# EAGLE design RS485 to Neopixel (EAGLE 9.4.2)
RS485 to NeoPixel
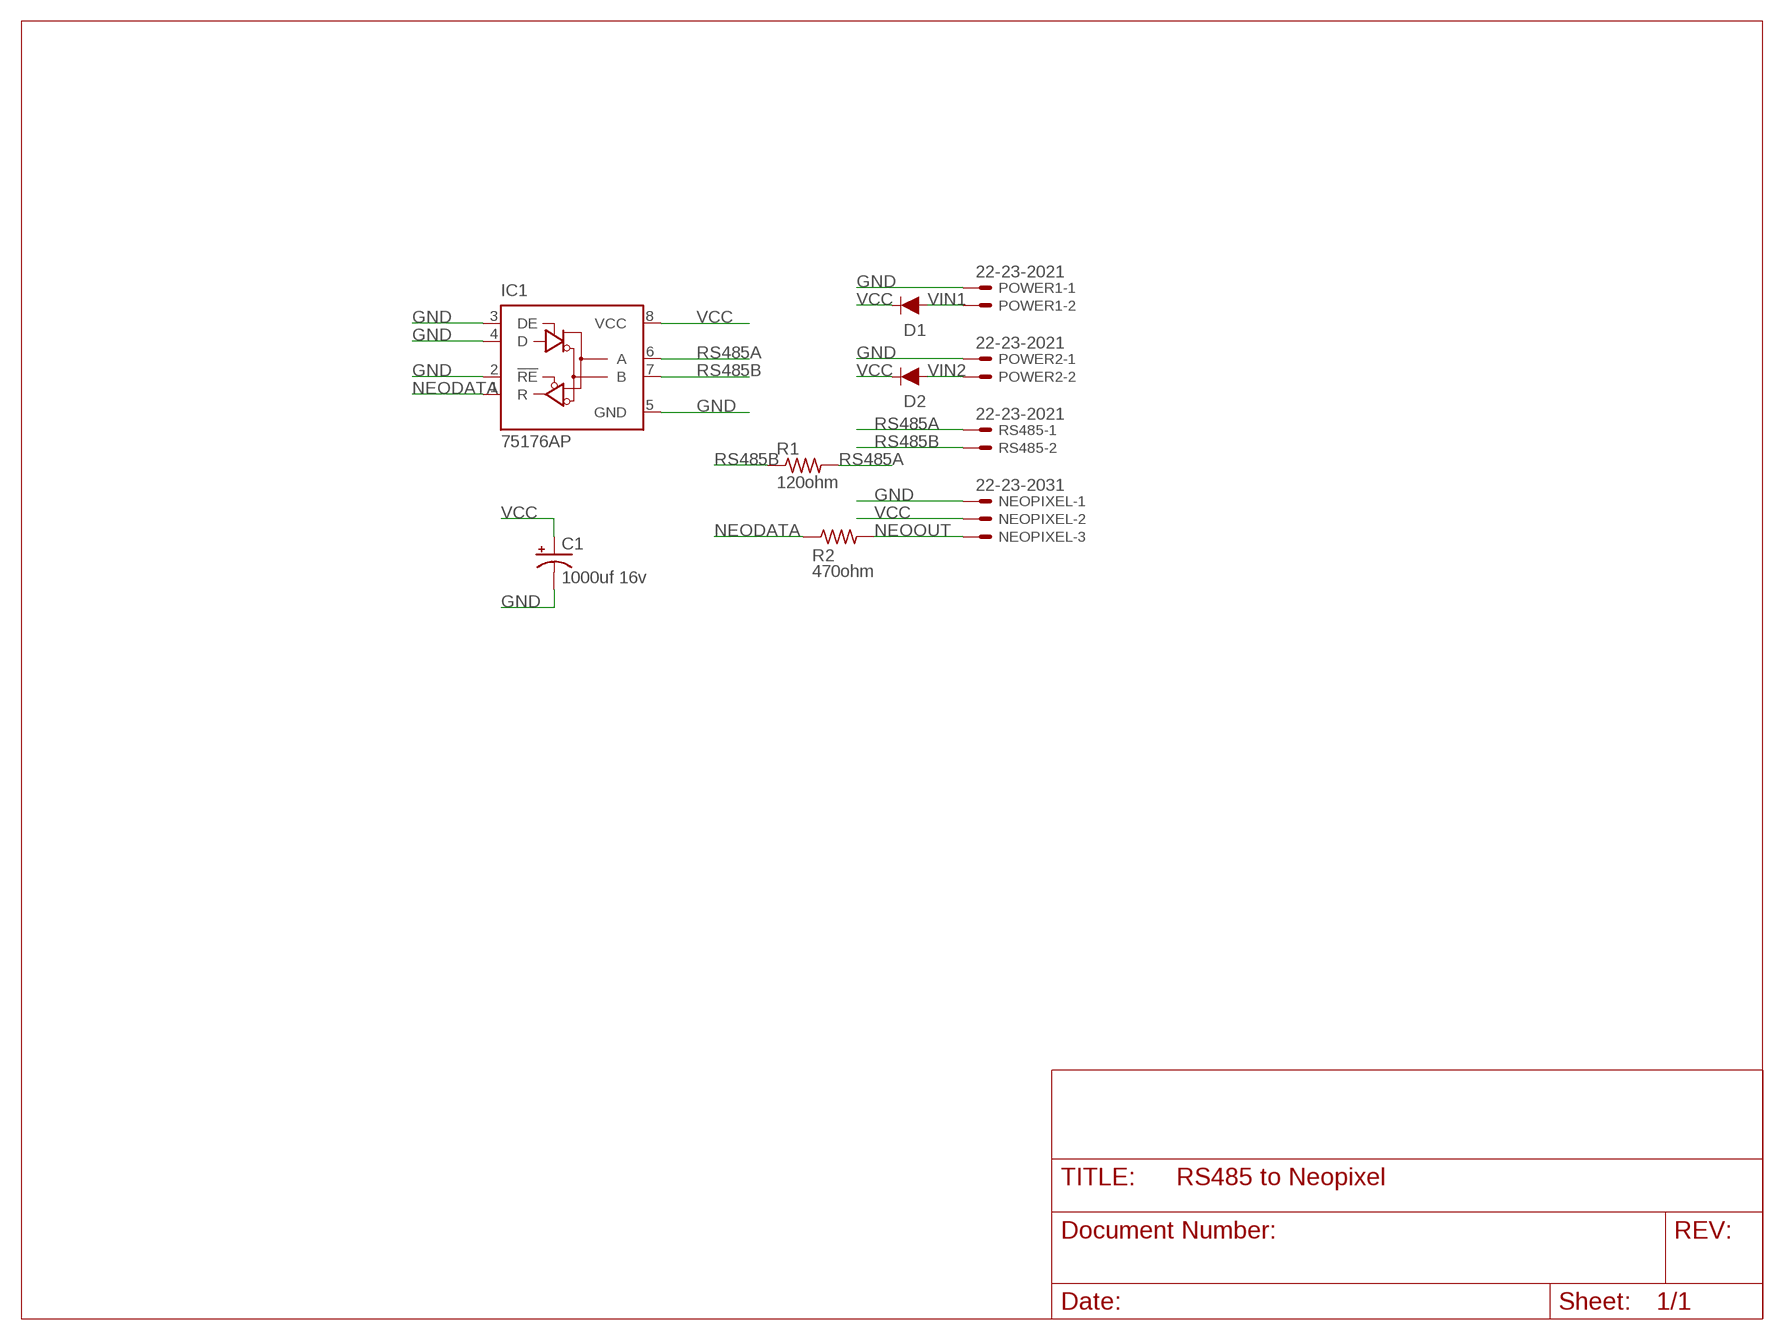
[diagram p0: schematic, sheet 1]

## Parts
C1  1000uf 16v  1000UF-RADIAL-5MM-25V-20%  [CPOL-RADIAL-5MM-10MM]
D1  1A/50V/1.1V  DIODE-PTH  [DIODE-1N4001]
D2  1A/50V/1.1V  DIODE-PTH  [DIODE-1N4001]
IC1  75176AP  [DIL08]
NEOPIXEL  22-23-2031  [22-23-2031]
POWER1  22-23-2021  [22-23-2021]
POWER2  22-23-2021  [22-23-2021]
R1  120ohm  R-US_0207/10  [0207/10]
R2  470ohm  R-US_0207/10  [0207/10]
RS485  22-23-2021  [22-23-2021]

## Nets
GND: C1.- IC1.2(!RE) IC1.3(DE) IC1.4(D) IC1.5(GND) NEOPIXEL.1 POWER1.1 POWER2.1
NEODATA: IC1.1(R) R2.1
NEOOUT: NEOPIXEL.3 R2.2
RS485A: IC1.6(A) R1.2 RS485.1
RS485B: IC1.7(B) R1.1 RS485.2
VCC: C1.+ D1.C D2.C IC1.8(VCC) NEOPIXEL.2
VIN1: D1.A POWER1.2
VIN2: D2.A POWER2.2

## Library data of the parts
C1 = SparkFun-Capacitors:1000UF: 1,000µF/1mF ceramic capacitors A capacitor is a passive two-terminal electrical component used to store electrical energy temporarily in an electric field. CAP-08070; PROD_ID: CAP-09538; VALUE: 1mF
D1 D2 = SparkFun-DiscreteSemi:DIODE: Diode These are standard reverse protection diodes and small signal diodes. SparkFun Products: SparkFun SparkPunk Sound Kit <https://www.sparkfun.com/products/11177> SparkFun ESP8266 Thing <https://www.sparkfun.com/products/13231>; PROD_ID: DIO-09176
IC1 = 751xx:75176A: DIFFERENTIAL BUS TRANSCEIVER Source: http://focus.ti.com/lit/ds/symlink/sn75176a.pdf
NEOPIXEL = con-molex:22-23-2031: .100" (2.54mm) Center Header - 3 Pin; MF: MOLEX; MPN: 22-23-2031; OC_FARNELL: 1462950; OC_NEWARK: 30C0862
POWER1 POWER2 RS485 = con-molex:22-23-2021: .100" (2.54mm) Center Header - 2 Pin; MF: MOLEX; MPN: 22-23-2021; OC_FARNELL: 1462926; OC_NEWARK: 25C3832
R1 R2 = rcl:R-US_: RESISTOR, American symbol; SPICEPREFIX: R

## Board
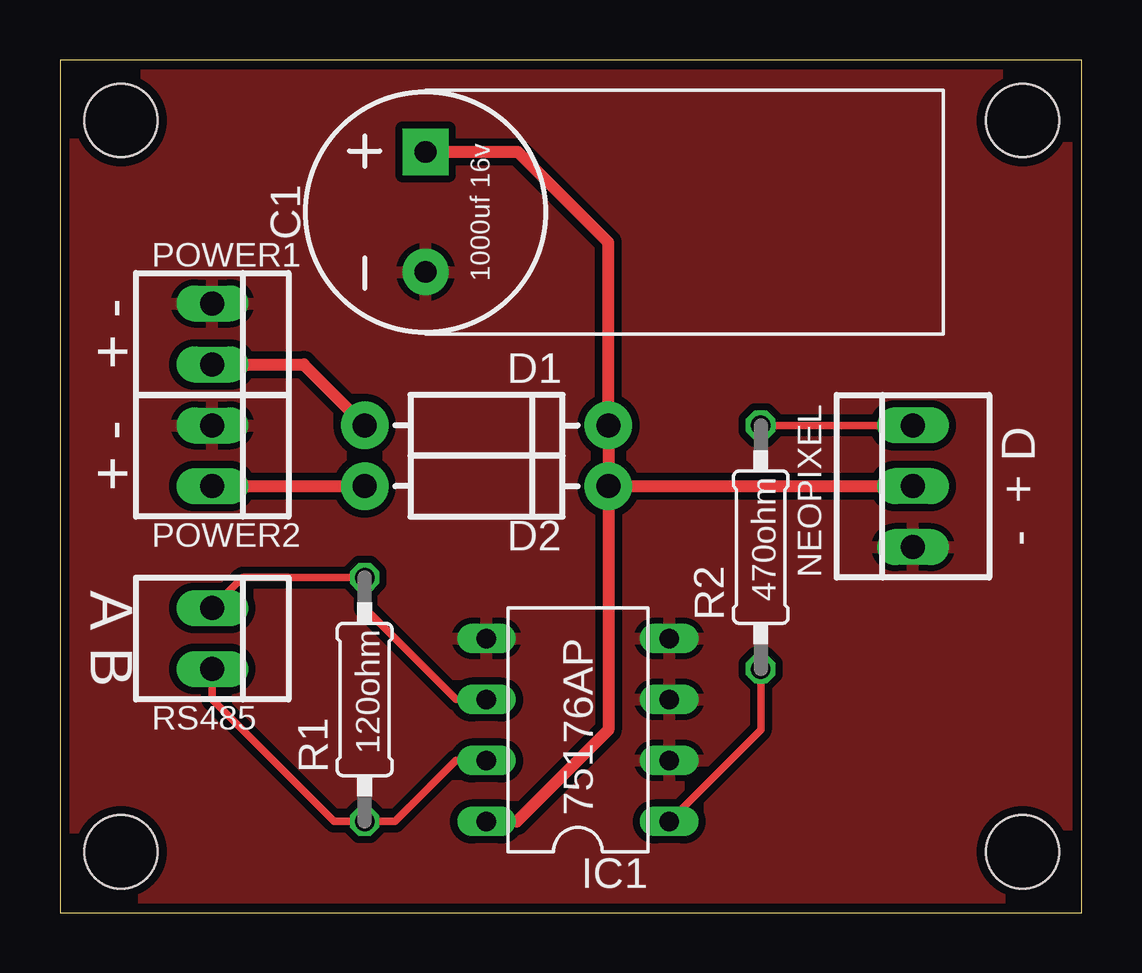
[diagram p1: board, top side]
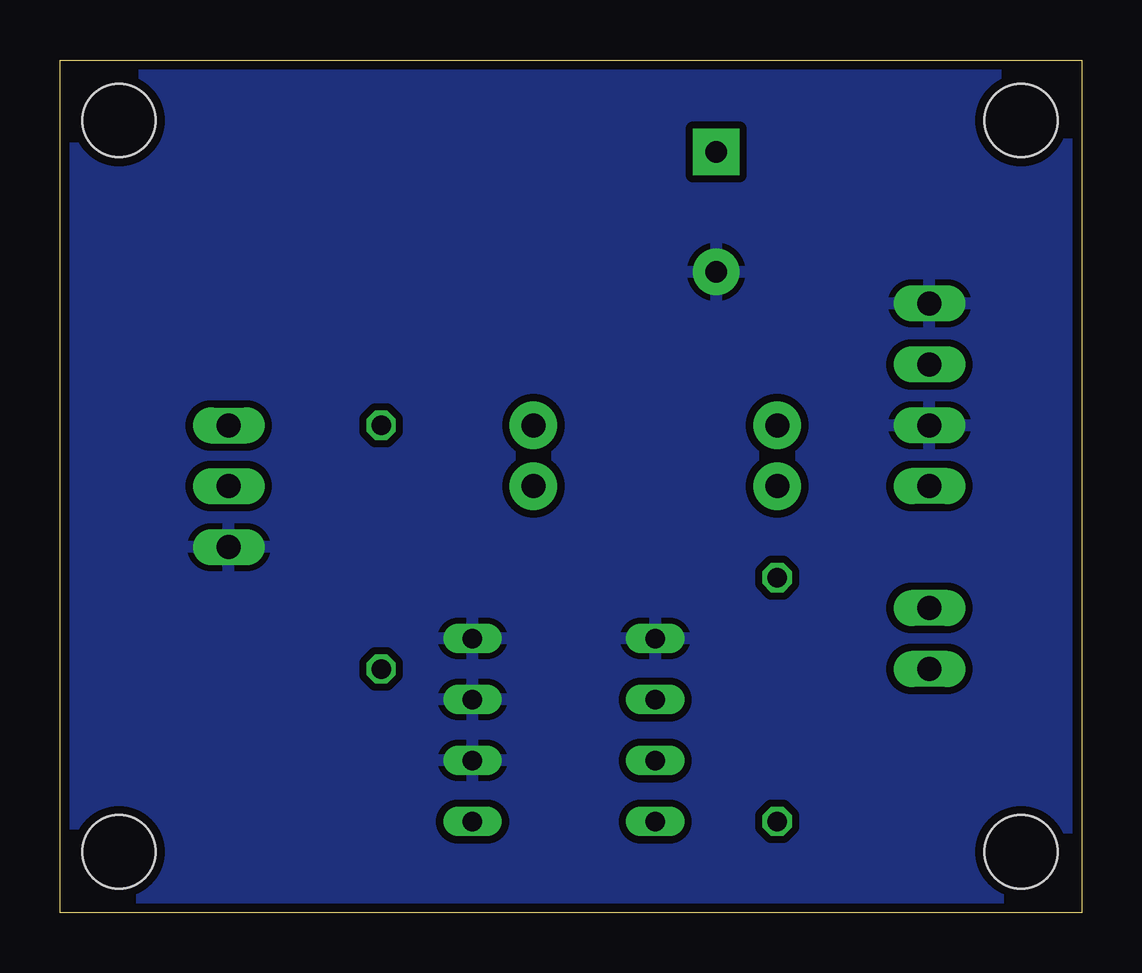
[diagram p2: board, bottom side, seen from below]

Size 42.6 x 35.55 mm. Coordinates in mm from the lower left corner, seen from the top.
Outline: 0,0 42.6,0 42.6,35.55 0,35.55 0,0
Copper layers (1*16): Top 0.035559375mm / dielectric 1.6mm / Bottom 0.035559375mm
Design rules "oshpark-2layer": minimum track width 6mil, minimum drill 10mil, track to track 6mil, track to pad 6mil, pad to pad 6mil, via to via 6mil, smd to smd 6mil, copper to edge 15mil, drill to drill 6mil, minimum pad ring 5mil, minimum via ring 5mil, stop-mask expansion 2.5mil, vias tented up to drill 0mil, thermal gap 10mil
Holes 3.05 mm at 2.54,2.54 40.13,2.54 40.13,33.02 2.54,33.02

### Footprints (pad centres in the part's own frame; a part is rotated, then mirrored left to right if it is on the bottom)
CPOL-RADIAL-5MM-10MM = drill 0.9 pad 1.93 square: + 2.5,0 | drill 0.9 pad 1.93: - -2.5,0
DIODE-1N4001 = drill 1 pad 1.981: A -5.08,0; C 5.08,0
DIL08 = drill 0.813 long: 1 -3.81,-3.81; 2 -1.27,-3.81; 3 1.27,-3.81; 4 3.81,-3.81; 5 3.81,3.81; 6 1.27,3.81; 7 -1.27,3.81; 8 -3.81,3.81
22-23-2031 = drill 1 long: 1 -2.54,0; 2 0,0; 3 2.54,0
22-23-2021 = drill 1 long: 1 -1.27,0; 2 1.27,0
0207/10 = drill 0.813 octagon: 1 -5.08,0; 2 5.08,0

### Placement (x,y rotation side)
C1  15.24,29.21 90 top
D1  17.78,20.32 0 top
D2  17.78,17.78 0 top
IC1  21.59,7.62 90 top
NEOPIXEL  35.56,17.78 90 top
POWER1  6.35,24.13 270 top
POWER2  6.35,19.05 270 top
R1  12.7,8.89 90 top
R2  29.21,15.24 90 top
RS485  6.35,11.43 270 top

### Tracks (layer width: path | path; a pad name or v marks a point on that pad's centre or on a via)
GND
  pour Top (isolate 0.305): 0,35.56 43.18,35.56 43.18,0 0,0
  pour Bottom (isolate 0.305): 0,35.56 43.18,35.56 43.18,3.81 44.45,2.54 44.45,0 0,0
NEODATA
  Top 0.305: R2.1 29.21,7.62 IC1.1
NEOOUT
  Top 0.305: NEOPIXEL.3 R2.2
RS485A
  Top 0.305: RS485.1 7.62,13.97 R1.2 12.7,12.7 16.51,8.89 IC1.6
RS485B
  Top 0.305: IC1.7 16.51,6.35 13.97,3.81 R1.1 11.43,3.81 6.35,8.89 RS485.2
VCC
  Top 0.508: C1.+ 19.09,31.71 22.86,27.94 D1.C D2.C | D2.C NEOPIXEL.2 | IC1.8 19.05,3.81 22.86,7.62 D2.C
VIN1
  Top 0.508: POWER1.2 10.16,22.86 D1.A
VIN2
  Top 0.508: POWER2.2 D2.A

### Text on the board
tNames: + - | + - | - + D | A B